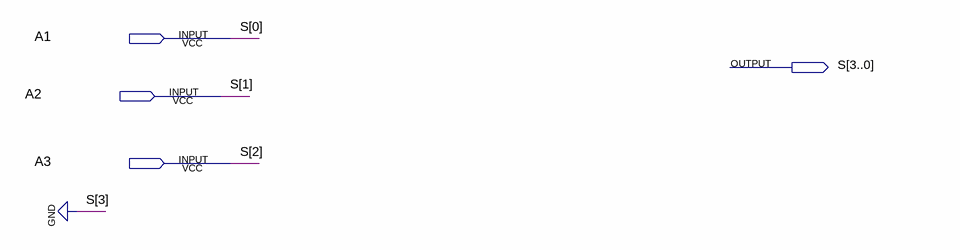
[diagram p0: schematic sheet]
// Quartus schematic Div.bdf as structural Verilog: 0 symbols, 4 pins
module Div (
  input  A1,
  input  A2,
  input  A3,
  output [3:0] S
);


  assign S = {1'b0, A3, A2, A1};
endmodule
